# Altium schematic sheet Test_PCB.SchDoc
size A4
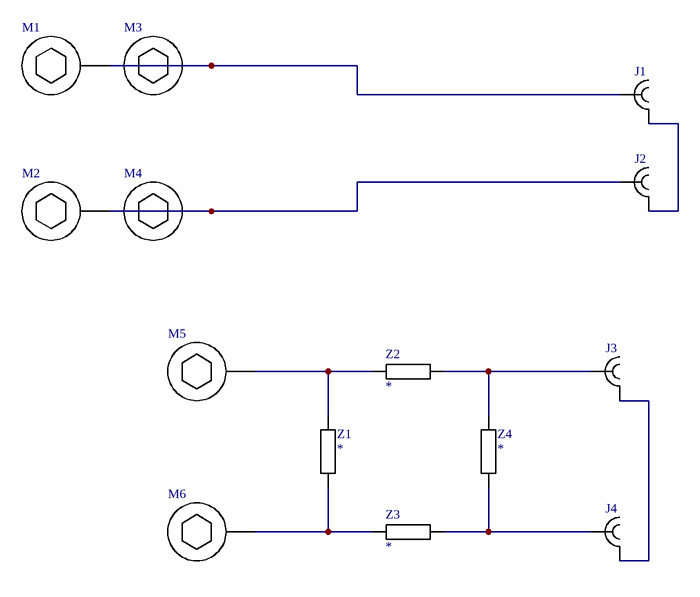
[diagram p0: Test_PCB.SchDoc]

## Parts
J1  CONSMA001-G  [SMA TH Vertical Linx CONSMA001-G]  (value not drawn)
J2  CONSMA001-G  [SMA TH Vertical Linx CONSMA001-G]  (value not drawn)
J3  CONSMA001-G  [SMA TH Vertical Linx CONSMA001-G]  (value not drawn)
J4  CONSMA001-G  [SMA TH Vertical Linx CONSMA001-G]  (value not drawn)
M1  (no value)  [Screw Hex Socket M2.5X4 Connected]
M2  (no value)  [Screw Hex Socket M2.5X4 Connected]
M3  (no value)  [Screw Hex Socket M2.5X4 Connected]
M4  (no value)  [Screw Hex Socket M2.5X4 Connected]
M5  (no value)  [Screw Hex Socket M2.5X4 Connected]
M6  (no value)  [Screw Hex Socket M2.5X4 Connected]
Z1  *  [RESISTOR 2012 REFLOW]
Z2  *  [RESISTOR 2012 REFLOW]
Z3  *  [RESISTOR 2012 REFLOW]
Z4  *  [RESISTOR 2012 REFLOW]

## Nets
NetJ1_1: J1.1 M1.1 M3.1
NetJ1_2: J1.2 J2.2
NetJ2_1: J2.1 M2.1 M4.1
NetJ3_1: J3.1 Z2.2 Z4.2
NetJ3_2: J3.2 J4.2
NetJ4_1: J4.1 Z3.2 Z4.1
NetM5_1: M5.1 Z1.2 Z2.1
NetM6_1: M6.1 Z1.1 Z3.1

## Library data of the parts
J1-J4 = SMA TH VERTICAL LINX CONSMA001-G: Value: CONSMA001-G
M1-M6 = Screw Hex Socket Connected: Screw Hex Socket Connected BN610
Z1-Z4 = Resistor: Value: *